# Altium schematic sheet Bubble_OCB100.SchDoc: OCB100 Bubble Sensor
size 199 x 160 mm; Date: 9/28/2024; DrawnBy: Yasir Shahzad; Organization: Mastermind Electronics; Revision: 1.0; SheetNumber: 1; SheetTotal: 1; SPICEModelCacheTUTOSKWT: <root> / <DocumentId>TUTOSKWT</DocumentId> / <CacheFrame Number="0"> / <Model Name="zener" Kind="MDL"> / <Text>*ZENER / *Default Zener 10V @ 10mA / *Zener Diode Pinout: A,K / .MODEL ZENER D( BV=10 IBV=10E-3 )</Text> / </Model> / </CacheFrame> / </root>
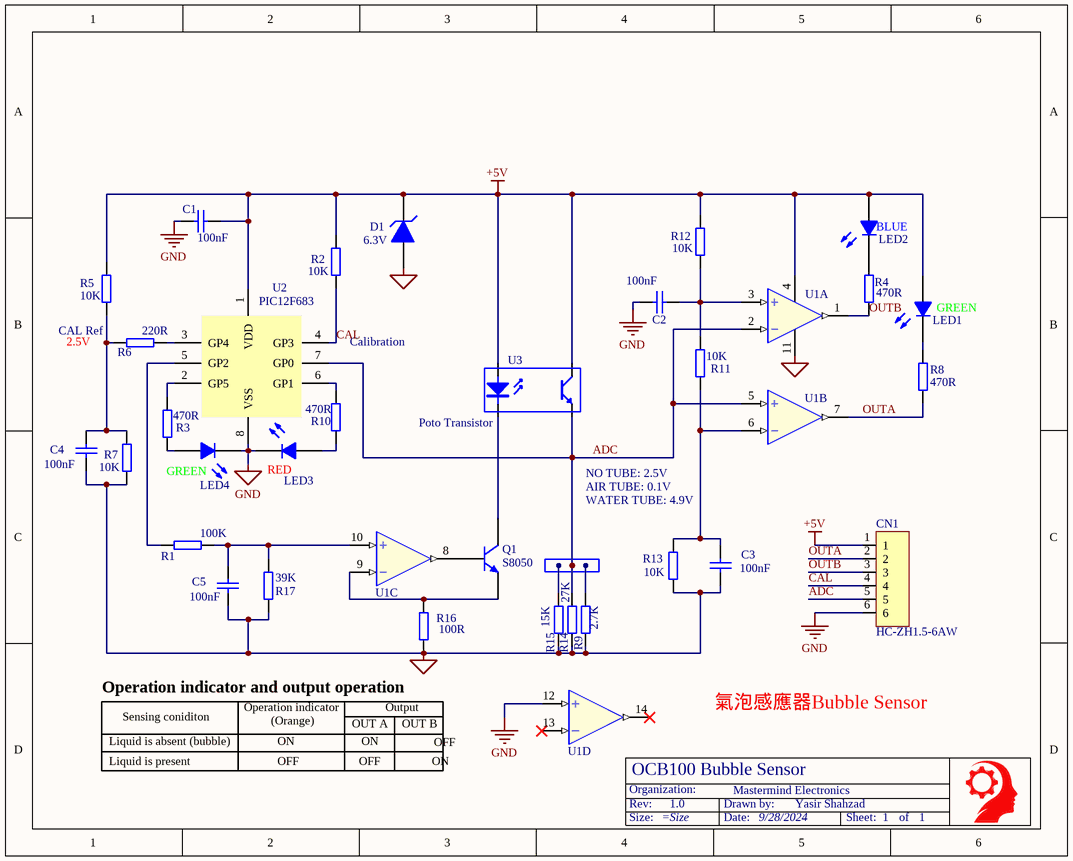
[diagram p0: Bubble_OCB100.SchDoc]

## Parts
*  TitleBlock  (value not drawn)  (graphical)
C1  100nF  [C0603-NO]  (value not drawn)
C2  100nF  [C0603-NO]  (value not drawn)
C3  100nF  [C0603-NO]  (value not drawn)
C4  100nF  [C0603-NO]  (value not drawn)
C5  100nF  [C0603-NO]  (value not drawn)
CN1  HC-ZH1.5-6AW  [CONN-TH_6P-P1.50_HCTL_C-ZH1.5-6AW]
D1  D Zener  [SOD-323]  (value not drawn)
LED1  LED  [CHIPLED_0603 - NO]  (value not drawn)
LED2  LED  [CHIPLED_0603 - NO]  (value not drawn)
LED3  LED  [CHIPLED_0603 - NO]  (value not drawn)
LED4  LED  [CHIPLED_0603 - NO]  (value not drawn)
P1  Header 3  [HDR1X3]  (value not drawn)
Q1  S8050  [SOT23]
R1  100kΩ  [R0603-NO]  (value not drawn)
R2  10kΩ  [R0603-NO]  (value not drawn)
R3  470Ω  [R0603-NO]  (value not drawn)
R4  470Ω  [R0603-NO]  (value not drawn)
R5  10kΩ  [R0603-NO]  (value not drawn)
R6  220Ω  [R0603-NO]  (value not drawn)
R7  10kΩ  [R0603-NO]  (value not drawn)
R8  470Ω  [R0603-NO]  (value not drawn)
R9  2.7kΩ  [R0603-NO]  (value not drawn)
R10  470Ω  [R0603-NO]  (value not drawn)
R11  10kΩ  [R0603-NO]  (value not drawn)
R12  10kΩ  [R0603-NO]  (value not drawn)
R13  10kΩ  [R0603-NO]  (value not drawn)
R14  27kΩ  [R0603-NO]  (value not drawn)
R15  15kΩ  [R0603-NO]  (value not drawn)
R16  100Ω  [R0805-NO]  (value not drawn)
R17  39kΩ  [R0603-NO]  (value not drawn)
U1  LM324  [SOIC127P600X175-14N]  (value not drawn)  (parts A,B,C,D of 4)
U2  PIC12F683  [SOIC-8E]
U3  Poto Transistor  [U_Shape_Opto]

## Nets
+5V: C1.1 CN1.1 D1.K LED1.A LED2.A R2.1 R5.2 R12.2 U1.4(VCC) U2.1(VDD) U3.1(A) U3.3(C)
GND: C1.2 C2.2 C3.1 C4.2 C5.1 CN1.6 D1.A LED3.C(K) LED4.C(K) R7.2 R9.1 R13.1 R14.1 R15.1 R16.1 R17.1 U1.11(GND) U1.12(D+) U2.8(VSS)
ADC: CN1.5 P1.2 R14.2 U1.2(A-) U1.5(B+) U2.7(GP0) U3.4(E)
CAL: CN1.4 R2.2 U2.4(GP3)
OUTA: CN1.2 R8.2 U1.7(OB)
OUTB: CN1.3 R4.2 U1.1(OA)
NetC2_1: C2.1 R11.1 R12.1 U1.3(A+)
NetC3_2: C3.2 R11.2 R13.2 U1.6(B-)
NetC4_1: C4.1 R5.1 R6.1 R7.1
NetC5_2: C5.2 R1.2 R17.2 U1.10(C+)
NetLED1_C: LED1.C(K) R8.1
NetLED2_C: LED2.C(K) R4.1
NetLED3_A: LED3.A R10.2
NetLED4_A: LED4.A R3.1
NetP1_1: P1.1 R9.2
NetP1_3: P1.3 R15.2
NetQ1_1: Q1.1(B) U1.8(OC)
NetQ1_2: Q1.2(E) R16.2 U1.9(C-)
NetQ1_3: Q1.3(C) U3.2(K)
NetR1_1: R1.1 U2.5(GP2)
NetR3_2: R3.2 U2.2(GP5)
NetR6_2: R6.2 U2.3(GP4)
NetR10_1: R10.1 U2.6(GP1)

Not connected (* = marked no-connect by the designer): U1 13(D-)* 14(OD)*

## Notes on the sheet
- (near C1) 100nF
- (near R2) 10K
- 6.3V
- (near R12) 10K
- (near LED2) BLUE
- CAL Ref
- 2.5V
- (near R5) 10K
- (near R6) 220R
- Calibration
- (near C2) 100nF
- (near R4) 470R
- (near LED1) GREEN
- (near R11) 10K
- (near R8) 470R
- (near C4) 100nF
- 10K
- (near LED4) GREEN
- 470R
- (near LED3) RED
- NO TUBE: 2.5V
- (near R1) 100K
- AIR TUBE: 0.1V
- WATER TUBE: 4.9V
- (near C5) 100nF
- (near R17) 39K
- 27K
- (near R13) 10K
- (near C3) 100nF
- (near R16) 100R
- (near R15) 15K
- (near R9) 2.7K
- (near R16) Operation indicator and output operation
- Liquid is absent (bubble)
- Sensing coniditon
- Operation indicator
- (Orange)
- ON
- OUT A
- Output
- OUT B
- OFF
- 氣泡感應器Bubble Sensor
- Liquid is present
- (in symbol TitleBlock) Organization:; Rev:; Drawn by:; Size:; Date:; Sheet:; of

## Library data of the parts
* = TitleBlock: Title Block for Schematic Sheets
C1-C5 = Cap_0603: Capacitor, X5R, ±10%, 6.3V; Part Number: C0603-N.C.; Manufacturer: N.A.; Artikkelnr Noca: 20069060; Datasheet: *; LatestRevisionDate: 2009-11-23; Pin Count: 2; Publisher: Nordic Semiconductor; Published: 2009-05-08; Value: 100nF; Volts: 6.3V; Supplier: *; Supplier part number: *; 2nd source Supplier: *; 2nd source part number: *; Footprint Doc: 0603; Artikkelnr Simpro: N.A.; Manufacturer Part Number: N.A.
CN1 = HC-ZH1.5-6AW: 1x6P 6P P=1.5mm Wire To Board Connector ROHS; Manufacturer: HCTL(华灿天禄); Add into BOM: yes; Pitch: 1.5mm; Reference Series: ZH; Number of PINs Per Row: 6; Current Rating (Max): 1A; Rated Voltage (Max): 100V; Plastic Material: PBT; Flame Retardant Rating: UL94V-0; Supplementary Features: K-leg punch; Z-Height of the Board: 3.7mm; X-Length of Bottom Edge on Board (Spacing Line): 10.5mm; Symbol: HC-ZH1.5-6AW; Device: HC-ZH1.5-6AW; LCSC Part Name: 1x6P 间距:1.5mm 弯插 系列:ZH; Supplier Part: C2845569; Manufacturer Part: HC-ZH1.5-6AW; Supplier Footprint: 弯插,P=1.5mm; JLCPCB Part Class: Extended Part; Datasheet: https://atta.szlcsc.com/upload/public/pdf/source/20230711/CEA84C90BC30863458C9BDB0466F53F6.pdf; Supplier: LCSC; Convert to PCB: yes; Pins Structure: 1x6P; Mounting Style: Bend insert; Number of Pins: 6P; Number of Rows: 1; Row Spacing: -; Contact Material: Brass; Contact Plating: Tin; Operating Temperature Range: -25℃~+85℃; Colour: -; Y-Width of Bottom Edge on Board: -
D1 = Zener: Zener Diode; Published: 8-Jun-2000; LatestRevisionDate: 17-Jul-2002; LatestRevisionNote: Re-released for DXP Platform.; PackageReference: DIODE-0.7; Publisher: Altium Limited; PackageDescription: Diode, Thru-Hole; 2 Leads; 0.7 in Pin Spacing
LED1-LED4 = LEDCHIP-LED0603: SMD lamp beads
P1 = Header 3: Header, 3-Pin; LatestRevisionDate: 17-Jul-2002; LatestRevisionNote: Re-released for DXP Platform.; Publisher: Altium Limited
Q1 = NPN: NPN Bipolar Transistor; Published: 8-Jun-2000; LatestRevisionDate: 17-Jul-2002; LatestRevisionNote: Re-released for DXP Platform.; PackageReference: TO-226-AA; Publisher: Altium Limited; PackageDescription: TO, Flat Index; 3 In-Line, Axial Leads; Body Dia. 4.8mm; Leads 0.55 x 0.51 mm (max); Code_JEDEC: TO-226-AA
R1-R15 R17 = Res_0603: Resistor, ±1%, 0.100W; Part Number: R0603-N.C.Ω; Manufacturer: N.A.; Note: Chip Res; Manufacturer Part Number: N.A.; Datasheet: *; Footprint Doc: 0603; LatestRevisionDate: 2009-05-08; Pin Count: 2; Publisher: Nordic Semiconductor; Published: 2009-05-08; Supplier: *; Supplier part number: *; 2nd source Supplier: *; 2nd source part number: *; Artikkelnr Noca: N.A.; Artikkelnr Simpro: N.A.
  R1: Value: 100kΩ
  R2 R5 R7 R11-R13: Value: 10kΩ
  R3 R4 R8 R10: Value: 470Ω
  R6: Value: 220Ω
  R9: Value: 2.7kΩ
  R14: Value: 27kΩ
  R15: Value: 15kΩ
  R17: Value: 39kΩ
R16 = Res_0805: Resistor, ±1%, 0.200W; Manufacturer: *; Specification: ±1%
U1 = LM324: Four channels 15nA 0.5V/us 1.2MHz SOIC-14 Operational Amplifier ROHS
U3 = U-Shape_Optosens: 4-Pin Phototransistor Optocoupler; Published: 24-Mar-1999; LatestRevisionDate: 04-Mar-2005; LatestRevisionNote: Sch pins 3 & 4 Swapped.; DatasheetVersion: Nov-2003; PackageReference: DIP-4; Publisher: Altium Limited
U2 = PIC12F683: Name: PIC12F683